# Altium schematic sheet root.SchDoc
size A4
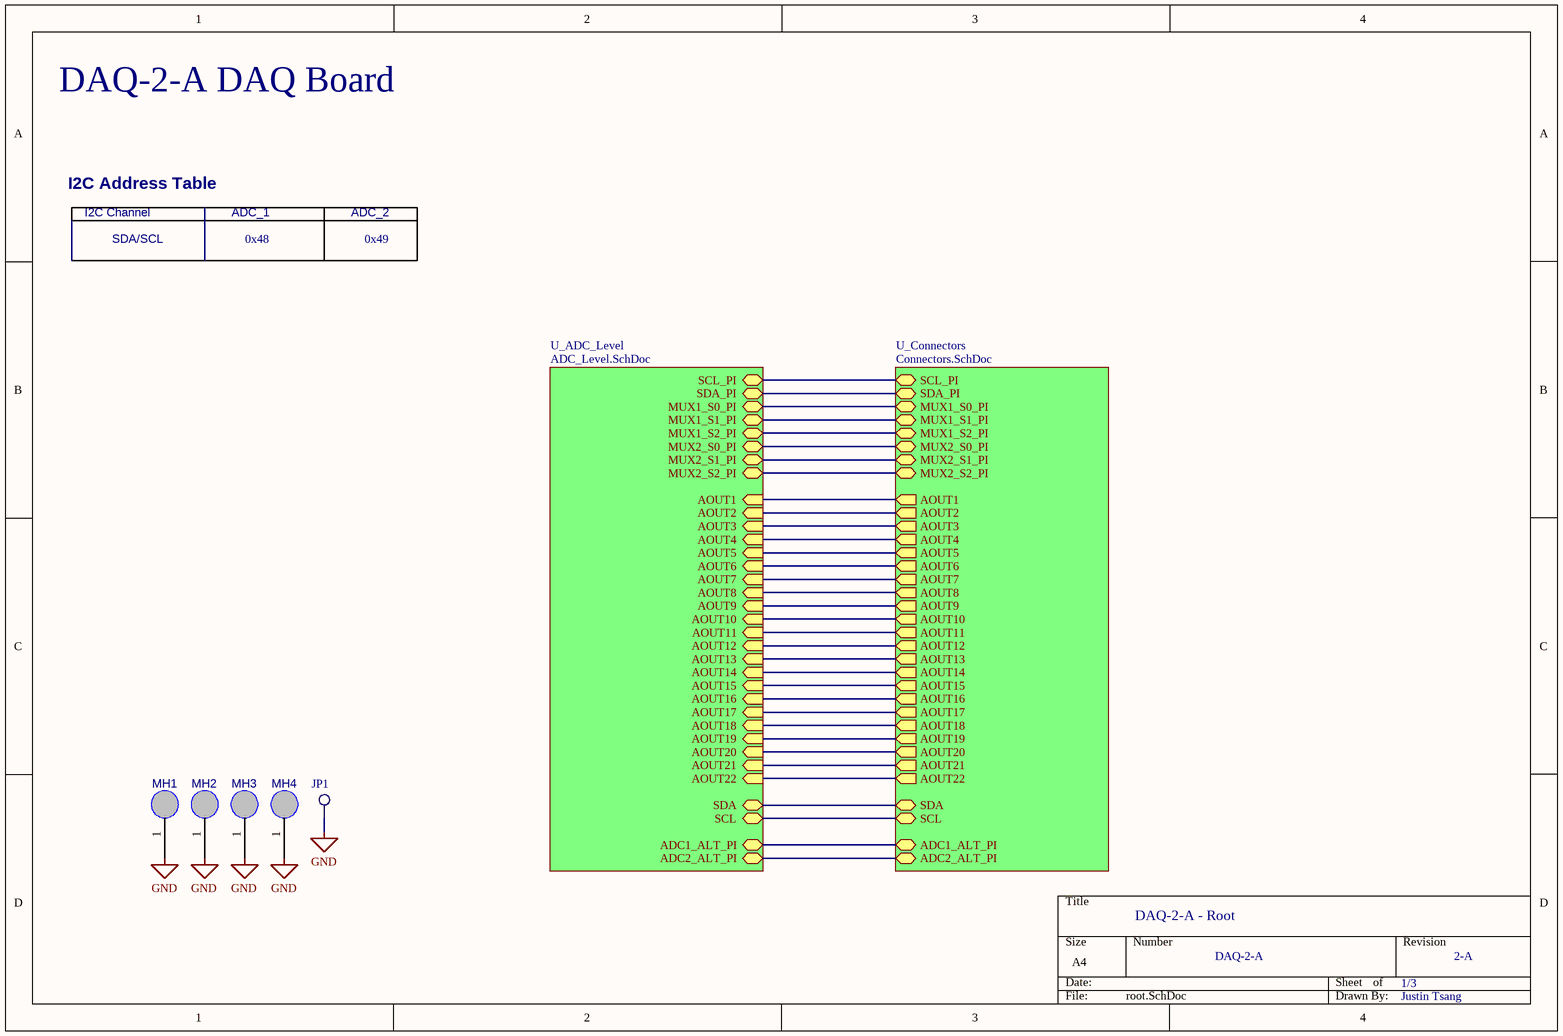
[diagram p0: root.SchDoc]

## Parts
JP1  Testpoint2  [TP2]  (value not drawn)
MH1  MountingHole  [MH2.7MM]  (value not drawn)
MH2  MountingHole  [MH2.7MM]  (value not drawn)
MH3  MountingHole  [MH2.7MM]  (value not drawn)
MH4  MountingHole  [MH2.7MM]  (value not drawn)

## Sub-sheets
U_ADC_Level = ADC_Level.SchDoc: SCL_PI (bidir), SDA_PI (bidir), MUX1_S0_PI (bidir), MUX1_S1_PI (bidir), MUX1_S2_PI (bidir), MUX2_S0_PI (bidir), MUX2_S1_PI (bidir), MUX2_S2_PI (bidir), AOUT17 (in), AOUT14 (in), AOUT7 (in), AOUT8 (in), AOUT16 (in), AOUT18 (in), AOUT9 (in), AOUT6 (in), AOUT12 (in), AOUT10 (in), AOUT19 (in), AOUT13 (in), AOUT1 (in), AOUT15 (in), AOUT20 (in), AOUT2 (in), AOUT3 (in), AOUT11 (in), AOUT5 (in), AOUT4 (in), SCL (bidir), SDA (bidir), AOUT21 (in), AOUT22 (in), ADC1_ALT_PI (bidir), ADC2_ALT_PI (bidir)
U_Connectors = Connectors.SchDoc: SCL_PI (bidir), SDA_PI (bidir), MUX1_S0_PI (bidir), MUX1_S1_PI (bidir), MUX1_S2_PI (bidir), MUX2_S0_PI (bidir), MUX2_S1_PI (bidir), MUX2_S2_PI (bidir), AOUT1 (out), AOUT2 (out), AOUT3 (out), AOUT4 (out), AOUT5 (out), AOUT6 (out), AOUT7 (out), AOUT8 (out), AOUT9 (out), AOUT10 (out), AOUT11 (out), AOUT12 (out), AOUT13 (out), AOUT14 (out), AOUT15 (out), AOUT16 (out), AOUT18 (out), AOUT19 (out), AOUT20 (out), AOUT17 (out), SCL (bidir), SDA (bidir), AOUT22 (out), AOUT21 (out), ADC1_ALT_PI (bidir), ADC2_ALT_PI (bidir)

## Nets
GND: JP1.1 MH1.1 MH2.1 MH3.1 MH4.1
(unnamed): sheet U_ADC_Level/SCL_PI, sheet U_Connectors/SCL_PI
(unnamed): sheet U_ADC_Level/SDA_PI, sheet U_Connectors/SDA_PI
(unnamed): sheet U_ADC_Level/MUX1_S0_PI, sheet U_Connectors/MUX1_S0_PI
(unnamed): sheet U_ADC_Level/MUX1_S1_PI, sheet U_Connectors/MUX1_S1_PI
(unnamed): sheet U_ADC_Level/MUX1_S2_PI, sheet U_Connectors/MUX1_S2_PI
(unnamed): sheet U_ADC_Level/MUX2_S0_PI, sheet U_Connectors/MUX2_S0_PI
(unnamed): sheet U_ADC_Level/MUX2_S1_PI, sheet U_Connectors/MUX2_S1_PI
(unnamed): sheet U_ADC_Level/MUX2_S2_PI, sheet U_Connectors/MUX2_S2_PI
(unnamed): sheet U_ADC_Level/AOUT17, sheet U_Connectors/AOUT17
(unnamed): sheet U_ADC_Level/AOUT14, sheet U_Connectors/AOUT14
(unnamed): sheet U_ADC_Level/AOUT7, sheet U_Connectors/AOUT7
(unnamed): sheet U_ADC_Level/AOUT8, sheet U_Connectors/AOUT8
(unnamed): sheet U_ADC_Level/AOUT16, sheet U_Connectors/AOUT16
(unnamed): sheet U_ADC_Level/AOUT18, sheet U_Connectors/AOUT18
(unnamed): sheet U_ADC_Level/AOUT9, sheet U_Connectors/AOUT9
(unnamed): sheet U_ADC_Level/AOUT6, sheet U_Connectors/AOUT6
(unnamed): sheet U_ADC_Level/AOUT12, sheet U_Connectors/AOUT12
(unnamed): sheet U_ADC_Level/AOUT10, sheet U_Connectors/AOUT10
(unnamed): sheet U_ADC_Level/AOUT19, sheet U_Connectors/AOUT19
(unnamed): sheet U_ADC_Level/AOUT13, sheet U_Connectors/AOUT13
(unnamed): sheet U_ADC_Level/AOUT1, sheet U_Connectors/AOUT1
(unnamed): sheet U_ADC_Level/AOUT15, sheet U_Connectors/AOUT15
(unnamed): sheet U_ADC_Level/AOUT20, sheet U_Connectors/AOUT20
(unnamed): sheet U_ADC_Level/AOUT2, sheet U_Connectors/AOUT2
(unnamed): sheet U_ADC_Level/AOUT3, sheet U_Connectors/AOUT3
(unnamed): sheet U_ADC_Level/AOUT11, sheet U_Connectors/AOUT11
(unnamed): sheet U_ADC_Level/AOUT5, sheet U_Connectors/AOUT5
(unnamed): sheet U_ADC_Level/AOUT4, sheet U_Connectors/AOUT4
(unnamed): sheet U_ADC_Level/SCL, sheet U_Connectors/SCL
(unnamed): sheet U_ADC_Level/SDA, sheet U_Connectors/SDA
(unnamed): sheet U_ADC_Level/AOUT21, sheet U_Connectors/AOUT21
(unnamed): sheet U_ADC_Level/AOUT22, sheet U_Connectors/AOUT22
(unnamed): sheet U_ADC_Level/ADC1_ALT_PI, sheet U_Connectors/ADC1_ALT_PI
(unnamed): sheet U_ADC_Level/ADC2_ALT_PI, sheet U_Connectors/ADC2_ALT_PI

## Notes on the sheet
- DAQ-2-A DAQ Board
- I2C Channel
- SDA/SCL
- I2C Address Table
- 0x48
- ADC_1
- 0x49
- ADC_2
- DAQ-2-A - Root
- DAQ-2-A
- 1/3
- 2-A
- Justin Tsang

## Library data of the parts
JP1 = Testpoint2: Single layer pad TP
MH1-MH4 = MH2.75mm: Mounting hole, 2.7mm; Case: TH